# EAGLE design LifterV03 (EAGLE 9.6.2)

## Sheet 1 of 2: Analog Circuit
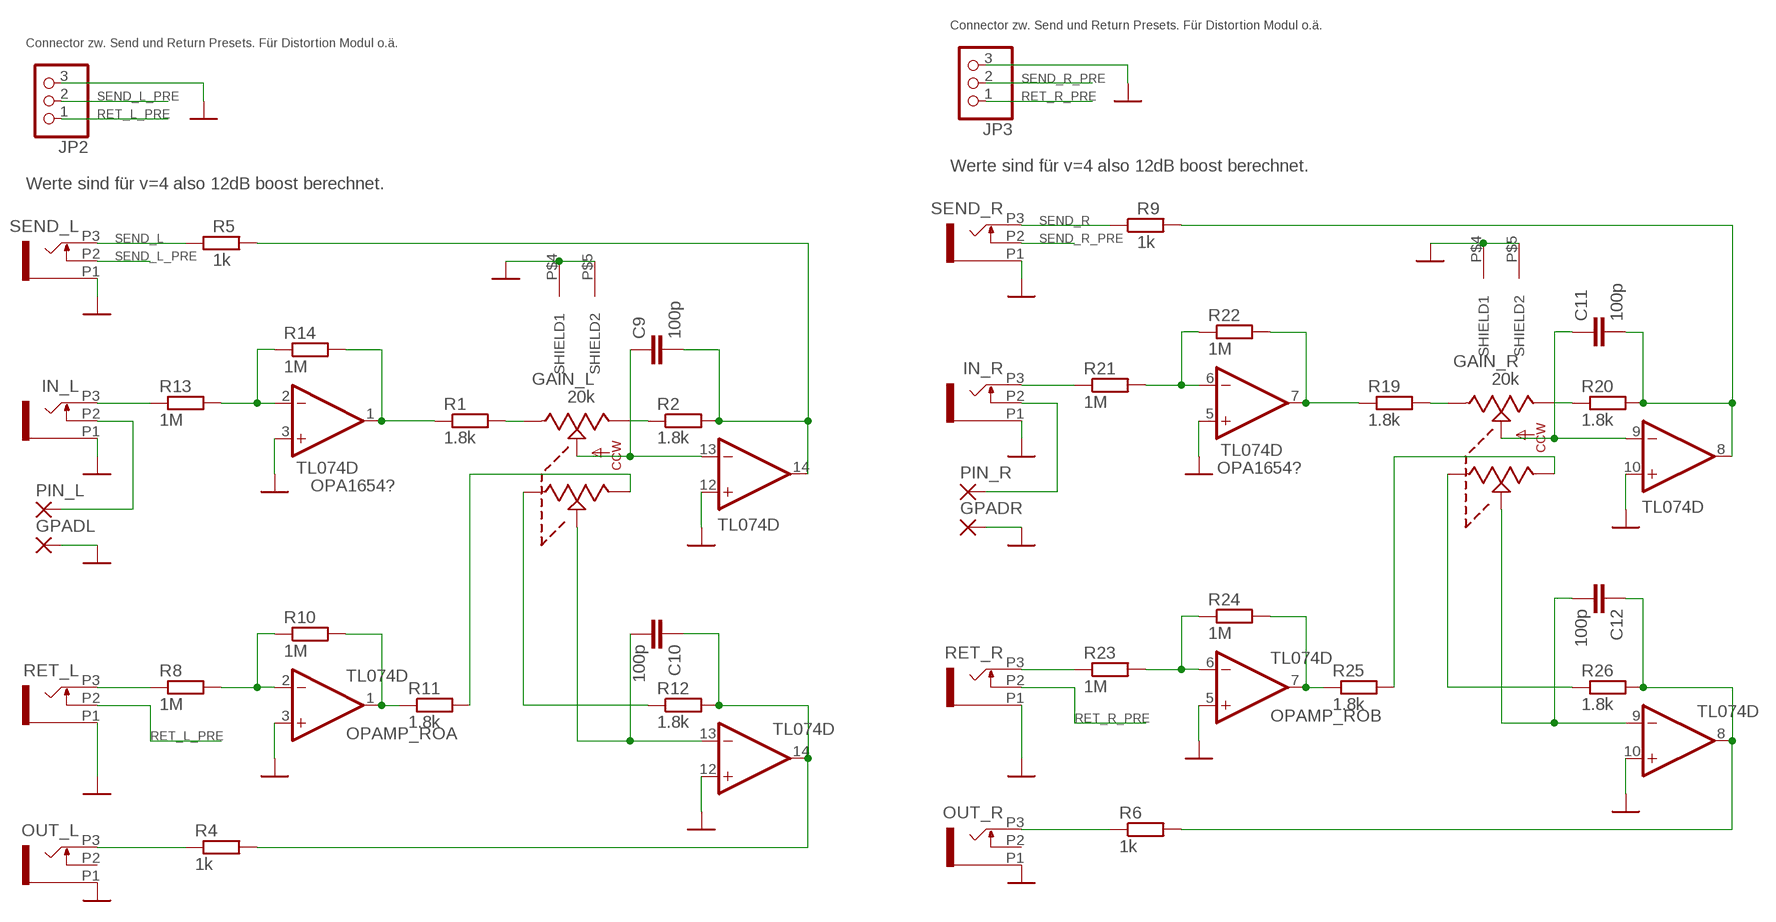
[diagram p0: schematic, sheet 1]

### Parts
C9  100p  C-EUC0603  [C0603]
C10  100p  C-EUC0603  [C0603]
C11  100p  C-EUC0603  [C0603]
C12  100p  C-EUC0603  [C0603]
GAIN_L  20k  POT_US_2X  [TT_2TAP_VERTICAL]
GAIN_R  20k  POT_US_2X  [TT_2TAP_VERTICAL]
GPADL  3,17/1,3  [3,17/1,3]
GPADR  3,17/1,3  [3,17/1,3]
IN_L  PJ301_THONKICONN6  [WQP_PJ_301M6]
IN_R  PJ301_THONKICONN6  [WQP_PJ_301M6]
JP2  PINHD-1X3  [1X03]
JP3  PINHD-1X3  [1X03]
OPAMP_IS  TL074D  [SO14]
OPAMP_RO  TL074D  [SO14]
OUT_L  PJ301_THONKICONN6  [WQP_PJ_301M6]
OUT_R  PJ301_THONKICONN6  [WQP_PJ_301M6]
PIN_L  3,17/1,3  [3,17/1,3]
PIN_R  3,17/1,3  [3,17/1,3]
R1  1.8k  R-EU_R0603  [R0603]
R2  1.8k  R-EU_R0603  [R0603]
R4  1k  R-EU_R0603  [R0603]
R5  1k  R-EU_R0603  [R0603]
R6  1k  R-EU_R0603  [R0603]
R8  1M  R-EU_R0603  [R0603]
R9  1k  R-EU_R0603  [R0603]
R10  1M  R-EU_R0603  [R0603]
R11  1.8k  R-EU_R0603  [R0603]
R12  1.8k  R-EU_R0603  [R0603]
R13  1M  R-EU_R0603  [R0603]
R14  1M  R-EU_R0603  [R0603]
R19  1.8k  R-EU_R0603  [R0603]
R20  1.8k  R-EU_R0603  [R0603]
R21  1M  R-EU_R0603  [R0603]
R22  1M  R-EU_R0603  [R0603]
R23  1M  R-EU_R0603  [R0603]
R24  1M  R-EU_R0603  [R0603]
R25  1.8k  R-EU_R0603  [R0603]
R26  1.8k  R-EU_R0603  [R0603]
RET_L  PJ301_THONKICONN6  [WQP_PJ_301M6]
RET_R  PJ301_THONKICONN6  [WQP_PJ_301M6]
SEND_L  PJ301_THONKICONN6  [WQP_PJ_301M6]
SEND_R  PJ301_THONKICONN6  [WQP_PJ_301M6]

### Nets
GND: GAIN_L.P$4(SHIELD1) GAIN_L.P$5(SHIELD2) GAIN_R.P$4(SHIELD1) GAIN_R.P$5(SHIELD2) GPADL.1(P) GPADR.1(P) IN_L.P1 IN_R.P1 JP2.3 JP3.3 OPAMP_IS.3(A:+IN) OPAMP_IS.5(B:+IN) OPAMP_IS.10(C:+IN) OPAMP_IS.12(D:+IN) OPAMP_RO.3(A:+IN) OPAMP_RO.5(B:+IN) OPAMP_RO.10(C:+IN) OPAMP_RO.12(D:+IN) OUT_L.P1 OUT_R.P1 RET_L.P1 RET_R.P1 SEND_L.P1 SEND_R.P1 ; also sheet 2
N$1: GAIN_L.CCW R2.1
N$2: GAIN_L.CW R1.2
N$3: C9.2 OPAMP_IS.14(D:OUT) R2.2 R5.2
N$4: C9.1 GAIN_L.CENTER OPAMP_IS.13(D:-IN)
N$5: IN_L.P3 R13.1
N$6: OPAMP_IS.2(A:-IN) R13.2 R14.1
N$8: OPAMP_IS.1(A:OUT) R1.1 R14.2
N$9: OUT_L.P3 R4.1
N$10: R8.1 RET_L.P3
N$11: IN_L.P2 PIN_L.1(P)
N$17: OPAMP_RO.2(A:-IN) R8.2 R10.1
N$18: GAIN_L.CW1 R12.1
N$21: OPAMP_RO.1(A:OUT) R10.2 R11.1
N$22: GAIN_L.CCW1 R11.2
N$23: C10.2 GAIN_L.CENTER1 OPAMP_RO.13(D:-IN)
N$24: C10.1 OPAMP_RO.14(D:OUT) R4.2 R12.2
N$26: IN_R.P2 PIN_R.1(P)
N$27: GAIN_R.CW R19.2
N$28: C11.1 GAIN_R.CENTER OPAMP_IS.9(C:-IN)
N$29: GAIN_R.CCW R20.1
N$30: IN_R.P3 R21.1
N$31: OPAMP_IS.6(B:-IN) R21.2 R22.1
N$32: OPAMP_IS.7(B:OUT) R19.1 R22.2
N$33: R23.1 RET_R.P3
N$34: OPAMP_RO.6(B:-IN) R23.2 R24.1
N$35: OPAMP_RO.7(B:OUT) R24.2 R25.1
N$36: GAIN_R.CCW1 R25.2
N$37: GAIN_R.CW1 R26.1
N$38: C12.2 GAIN_R.CENTER1 OPAMP_RO.9(C:-IN)
N$39: C11.2 OPAMP_IS.8(C:OUT) R9.2 R20.2
N$40: OUT_R.P3 R6.1
N$41: C12.1 OPAMP_RO.8(C:OUT) R6.2 R26.2
RET_L_PRE: JP2.1 RET_L.P2
RET_R_PRE: JP3.1 RET_R.P2
SEND_L: R5.1 SEND_L.P3 ; also sheet 2
SEND_L_PRE: JP2.2 SEND_L.P2
SEND_R: R9.1 SEND_R.P3 ; also sheet 2
SEND_R_PRE: JP3.2 SEND_R.P2
Unconnected: OUT_L.P2 OUT_R.P2

### Notes on the sheet
- Connector zw. Send und Return Presets. Für Distortion Modul o.ä.
- Connector zw. Send und Return Presets. Für Distortion Modul o.ä.
- Werte sind für v=4 also 12dB boost berechnet.
- Werte sind für v=4 also 12dB boost berechnet.
- OPA1654?
- OPA1654?

## Sheet 2 of 2: Power Supply
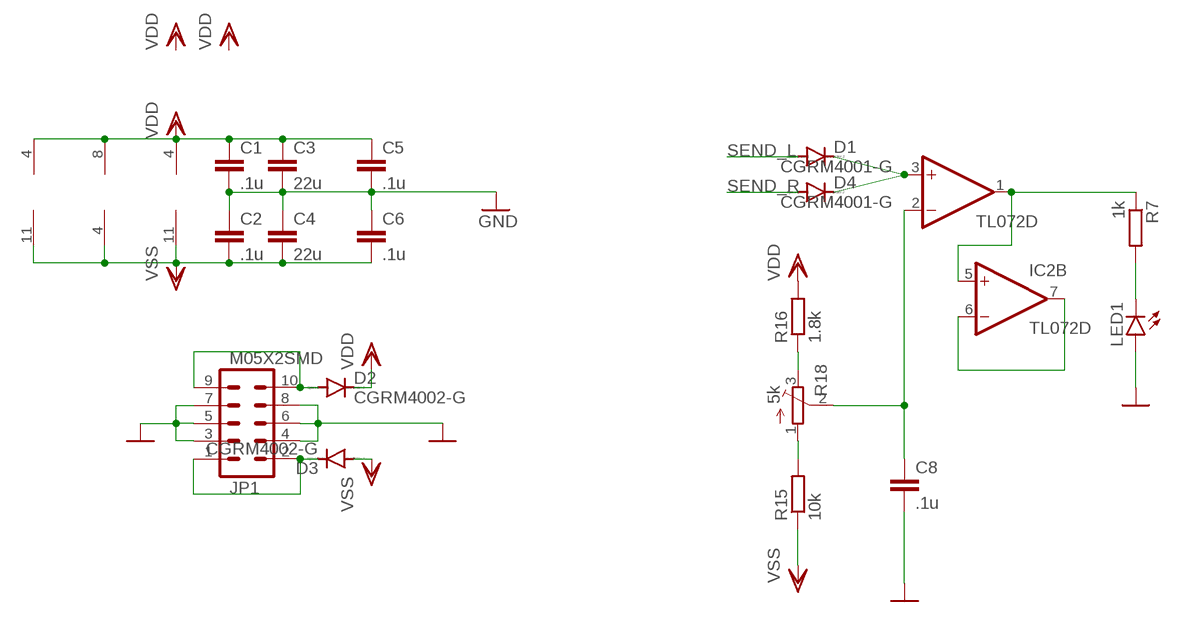
[diagram p1: schematic, sheet 2]

### Parts
C1  .1u  C-EUC0603  [C0603]
C2  .1u  C-EUC0603  [C0603]
C3  22u  C-EUC1210  [C1210]
C4  22u  C-EUC1210  [C1210]
C5  .1u  C-EUC0603  [C0603]
C6  .1u  C-EUC0603  [C0603]
C8  .1u  C-EUC0603  [C0603]
D1  CGRM4001-G  [SOD-123_MINI-SMA]
D2  CGRM4002-G  [SOD-123_MINI-SMA]
D3  CGRM4002-G  [SOD-123_MINI-SMA]
D4  CGRM4001-G  [SOD-123_MINI-SMA]
IC2  TL072D  [SO08]
JP1  M05X2SMD  [2X5-SMD]
LED1  LED3MM  [LED3MM]
R7  1k  R-EU_R0603  [R0603]
R15  10k  R-EU_R0603  [R0603]
R16  1.8k  R-EU_R0603  [R0603]
R18  5k  TRIM_EU-3223G  [3223G]

### Nets
GND: C1.2 C2.1 C3.2 C4.1 C5.2 C6.1 C8.2 JP1.3 JP1.4 JP1.5 JP1.6 JP1.7 JP1.8 LED1.A ; also sheet 1
N$7: IC2.6(B:-IN) IC2.7(B:OUT)
N$12: D2.A JP1.9 JP1.10
N$13: D1.C D4.C IC2.3(A:+IN)
N$14: D3.C JP1.1 JP1.2
N$15: LED1.K(C) R7.2
N$16: IC2.1(A:OUT) IC2.5(B:+IN) R7.1
N$19: C8.1 IC2.2(A:-IN) R18.2(S)
N$25: R16.1 R18.3(E)
N$44: R15.2 R18.1(A)
SEND_L: D1.A ; also sheet 1
SEND_R: D4.A ; also sheet 1
VDD [power]: C1.1 C3.1 C5.1 D2.C IC2.8(P:V+) OPAMP_IS.4(P:V+) OPAMP_RO.4(P:V+) R16.2
VSS [power]: C2.2 C4.2 C6.2 D3.A IC2.4(P:V-) OPAMP_IS.11(P:V-) OPAMP_RO.11(P:V-) R15.1

## Library data of the parts
C1-C6 C8-C12 = rcl:C-EU: CAPACITOR, European symbol; SPICEPREFIX: C
D1-D4 = diode:CGRM400*-G: Molded plasitc,JEDEC SOD-123/Mini SMA Source: Comchip CGRM4001-G.pdf
GAIN_L GAIN_R = og-pots:POT_US_2X
GPADL GPADR PIN_L PIN_R = wirepad:3,17/1,3: THROUGH-HOLE PAD
IC2 = linear:TL072: OP AMP
IN_L IN_R OUT_L OUT_R RET_L RET_R SEND_L SEND_R = og-pj301:PJ301_THONKICONN
JP1 = og-header:M05X2: Header 5x2 Standard 10-pin dual row 0.1" header. Commonly used with AVR-ISP. Use with Spark Fun Electronics SKU: PRT-00778
JP2 JP3 = pinhead:PINHD-1X3: PIN HEADER
LED1 = led:LED: LED OSRAM: - CHIPLED LG R971, LG N971, LY N971, LG Q971, LY Q971, LO R971, LY R971 LH N974, LH R974 LS Q976, LO Q976, LY Q976 LO Q996 - Hyper CHIPLED LW Q18S LB Q993, LB Q99A, LB R99A - SideLED LS A670, LO A670, LY A670, LG A670, LP A670 LB A673, LV A673, LT A673, LW A673 LH A674 LY A675 LS A676, LA A676, LO A676, LY A676, LW A676 LS A679, LY A679, LG A679 - Hyper Micro SIDELED® LS Y876, LA Y876, LO Y876, LY Y876 LT Y87S - SmartLED LW L88C, LW L88S LB L89C, LB L89S, LG L890 LS L89K, LO L89K, LY L89K LS L896, LA L896, LO L896, LY L896 - TOPLED LS T670, LO T670, LY T670, LG T670, LP T670 LSG T670, LSP T670, LSY T670, LOP T670, LYG T670 LG T671, LOG T671, LSG T671 LB T673, LV T673, LT T673, LW T673 LH T674 LS T676, LA T676, LO T676, LY T676, LB T676, LH T676, LSB T676, LW T676 LB T67C, LV T67C, LT T67C, LS T67K, LO T67K, LY T67K, LW E67C LS E67B, LA E67B, LO E67B, LY E67B, LB E67C, LV E67C, LT E67C LW T67C LS T679, LY T679, LG T679 LS T770, LO T770, LY T770, LG T770, LP T770 LB T773, LV T773, LT T773, LW T773 LH T774 LS E675, LA E675, LY E675, LS T675 LS T776, LA T776, LO T776, LY T776, LB T776 LHGB T686 LT T68C, LB T68C - Hyper Mini TOPLED® LB M676 - Mini TOPLED Santana® LG M470 LS M47K, LO M47K, LY M47K Source: http://www.osram.convergy.de LUXEON: - LUMILED® LXK2-PW12-R00, LXK2-PW12-S00, LXK2-PW14-U00, LXK2-PW14-V00 LXK2-PM12-R00, LXK2-PM12-S00, LXK2-PM14-U00 LXK2-PE12-Q00, LXK2-PE12-R00, LXK2-PE12-S00, LXK2-PE14-T00, LXK2-PE14-U00 LXK2-PB12-K00, LXK2-PB12-L00, LXK2-PB12-M00, LXK2-PB14-N00, LXK2-PB14-P00, LXK2-PB14-Q00 LXK2-PR12-L00, LXK2-PR12-M00, LXK2-PR14-Q00, LXK2-PR14-R00 LXK2-PD12-Q00, LXK2-PD12-R00, LXK2-PD12-S00 LXK2-PH12-R00, LXK2-PH12-S00 LXK2-PL12-P00, LXK2-PL12-Q00, LXK2-PL12-R00 Source: www.luxeon.com KINGBRIGHT: KA-3528ASYC Source: www.kingbright.com
OPAMP_IS OPAMP_RO = linear:TL074: OP AMP; SPICEPREFIX: J
R1 R2 R4-R16 R19-R26 = rcl:R-EU_: RESISTOR, European symbol; SPICEPREFIX: R
R18 = pot:TRIM_EU-: POTENTIOMETER; MOUSER: 652-TC33X-2-502G

## Net classes
1 power: width 0.406 mm

## Board
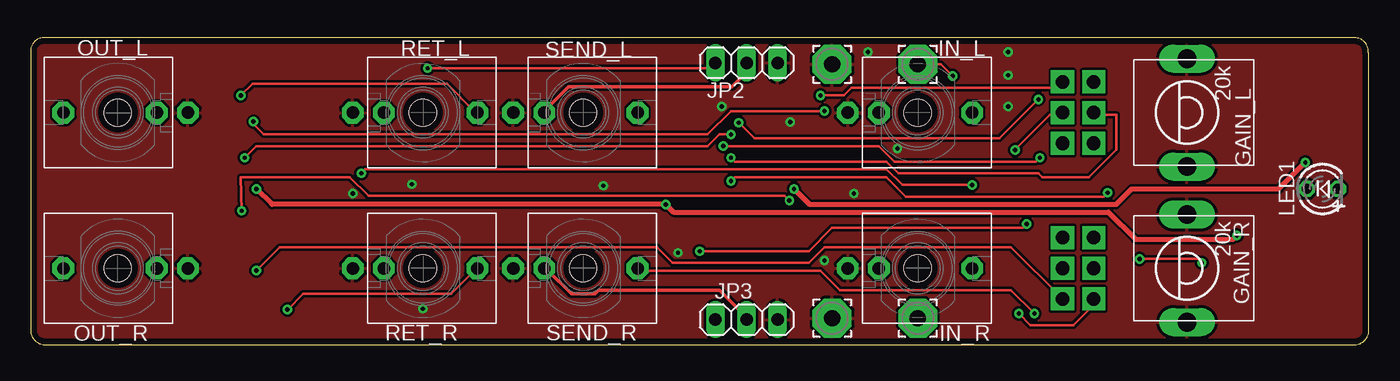
[diagram p2: board, top side]
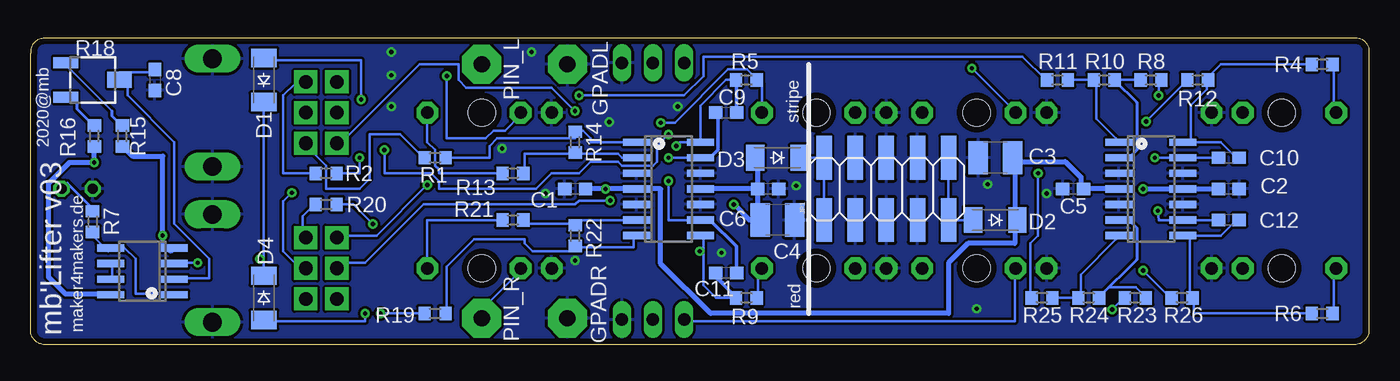
[diagram p3: board, bottom side, seen from below]

Size 109.21 x 25.03 mm. Coordinates in mm from the lower left corner, seen from the top.
Outline: 0,1.27 arc100 1.27,0 107.95,0 arc100 109.2,1.25 109.2,23.68 arc10 109.17,23.8 arc100 107.95,25.02 1.15,25.02 arc100 0,23.88 0,1.27
Copper layers (1*16): Top 0.035mm / dielectric 1.5mm / Bottom 0.035mm
Design rules "default *": minimum track width 8mil, minimum drill 0.35mm, track to track 8mil, track to pad 8mil, pad to pad 8mil, via to via 8mil, smd to smd 8mil, copper to edge 20mil, drill to drill 8mil, minimum pad ring 10mil, minimum via ring 8mil, stop-mask expansion 4mil, vias tented up to drill 0mil, thermal gap 10mil

### Footprints (pad centres in the part's own frame; a part is rotated, then mirrored left to right if it is on the bottom)
C0603 = smd 1.1 x 1: 1 -0.85,0; 2 0.85,0
C1210 = smd 1.6 x 2.7: 1 -1.4,0; 2 1.4,0
SOD-123_MINI-SMA = smd 1.5 x 2.1: A 1.8,0; C -1.8,0
TT_2TAP_VERTICAL = drill 1.118 pad 1.88 square: CCW 2.5,7.608; CCW1 2.5,10.148; CENTER 0,7.608; CENTER1 0,10.148; CW -2.5,7.608; CW1 -2.5,10.148 | drill 1.524 pad 2.184 long: P$4 -4.4,0; P$5 4.4,0
3,17/1,3 = drill 1.321 pad 3.175 octagon: 1 0,0
SO08 = smd 0.6 x 2.2: 1 -1.905,-2.6; 2 -0.635,-2.6; 3 0.635,-2.6; 4 1.905,-2.6; 5 1.905,2.6; 6 0.635,2.6; 7 -0.635,2.6; 8 -1.905,2.6
WQP_PJ_301M6 = drill 1.016 pad 1.778 octagon: P1 0,-5.715; P2 0,-3.175; P3 0,4.445 | hole 2.2: 0,0
2X5-SMD = smd 3.556 x 1.27: 1 -2.54,5.08; 2 2.54,5.08; 3 -2.54,2.54; 4 2.54,2.54; 5 -2.54,0; 6 2.54,0; 7 -2.54,-2.54; 8 2.54,-2.54; 9 -2.54,-5.08; 10 2.54,-5.08
1X03 = drill 1.016 long: 1 -2.54,0; 2 0,0; 3 2.54,0
LED3MM = drill 0.813 octagon: A -1.27,0; K 1.27,0
SO14 = smd 0.6 x 2.2: 1 -3.81,-2.6; 2 -2.54,-2.6; 3 -1.27,-2.6; 4 0,-2.6; 5 1.27,-2.6; 6 2.54,-2.6; 7 3.81,-2.6; 8 3.81,2.6; 9 2.54,2.6; 10 1.27,2.6; 11 0,2.6; 12 -1.27,2.6; 13 -2.54,2.6; 14 -3.81,2.6
R0603 = smd 1 x 1.1: 1 -0.85,0; 2 0.85,0
3223G = smd 2 x 0.9: 1 -2.2,1.4; 3 -2.2,-1.4 | smd 2 x 1.3: 2 2.2,0

### Placement (x,y rotation side)
C1  64.77,12.7 180 bottom
C2  11.43,12.7 180 bottom
C3  30.48,15.24 180 bottom
C4  48.26,10.16 180 bottom
C5  24.13,12.7 180 bottom
C6  49.03,12.7 180 bottom
C8  99.06,21.59 270 bottom
C9  52.46,18.93 0 bottom
C10  11.43,15.24 180 bottom
C11  52.46,5.85 180 bottom
C12  11.43,10.16 180 bottom
D1  90.17,21.59 90 bottom
D2  30.48,10.16 180 bottom
D3  48.26,15.24 180 bottom
D4  90.17,3.81 270 bottom
GAIN_L  94.37,18.93 90 top
GAIN_R  94.37,6.23 90 top
GPADL  65.41,22.86 0 top
GPADR  65.41,2.16 0 top
IC2  100.08,5.97 90 bottom
IN_L  72.39,18.93 270 top
IN_R  72.39,6.23 270 top
JP1  39.37,12.7 90 bottom
JP2  58.42,22.99 0 top
JP3  58.42,2.04 0 top
LED1  105.41,12.7 0 top
OPAMP_IS  57.15,12.7 270 bottom
OPAMP_RO  17.78,12.7 270 bottom
OUT_L  7.12,18.93 90 top
OUT_R  7.12,6.23 90 top
PIN_L  72.39,22.86 180 top
PIN_R  72.39,2.16 0 top
R1  76.2,15.24 180 bottom
R2  85.09,13.97 0 bottom
R4  3.81,22.86 180 bottom
R5  50.8,21.59 180 bottom
R6  3.81,2.54 180 bottom
R7  104.14,10.04 90 bottom
R8  17.78,21.59 180 bottom
R9  50.8,3.81 180 bottom
R10  21.59,21.59 180 bottom
R11  25.4,21.59 180 bottom
R12  13.97,21.59 0 bottom
R13  69.85,13.97 0 bottom
R14  64.77,16.51 90 bottom
R15  101.73,17.02 90 bottom
R16  104.02,17.02 270 bottom
R18  104.14,21.59 0 bottom
R19  76.2,2.54 180 bottom
R20  85.09,11.43 0 bottom
R21  69.85,10.16 0 bottom
R22  64.77,8.89 270 bottom
R23  19.05,3.81 0 bottom
R24  22.86,3.81 180 bottom
R25  26.67,3.81 180 bottom
R26  15.24,3.81 0 bottom
RET_L  32.01,18.93 270 top
RET_R  32.01,6.23 270 top
SEND_L  45.09,18.93 270 top
SEND_R  45.09,6.23 270 top

### Tracks (layer width: path | path; a pad name or v marks a point on that pad's centre or on a via)
GND  (via drill 0.35)
  other vias: 61.98,18.17 79.76,19.44 79.76,21.98 79.76,23.88 68.33,23.88 56.39,19.44 32.01,2.93 70.74,16.01 67.19,12.32 64.77,6.86 52.84,7.5 46.74,12.96 31.12,13.09 26.29,12.32
  pour Bottom: 110.49,26.67 110.49,-1.27 -1.27,-1.27 -1.27,26.67
  pour Top: 111.76,27.94 111.76,-1.27 -1.27,-1.27 -1.27,26.67 110.49,26.67
N$1
  Bottom 0.203: R2.1 88.59,13.97 88.59,20.32 87.63,21.28 87,21.28 GAIN_L.CCW
N$2
  Bottom 0.203: R1.2 77.16,15.24 79.06,17.15 81.54,17.15 81.54,13.53 82.36,12.7 85.09,12.7 85.09,14.61 86.68,16.2 GAIN_L.CW
N$3  (via drill 0.35)
  Top 0.203: v82.36,15.24 82.05,14.93 70.49,14.93 69.22,16.2 v56.52,16.2
  Bottom 0.203: R2.2 82.36,13.97 v82.36,15.24 | v56.52,16.2 56.2,16.51 OPAMP_IS.14 54.55,19.49 52.45,21.59 R5.2
  Bottom 0.305: C9.2 51.61,21.55 R5.2
N$4  (via drill 0.35)
  Top 0.203: v57.15,15.24 57.47,14.93 69.85,14.93 70.81,13.97 82.24,13.97 82.55,13.66 86.36,13.66 88.59,15.88 88.59,18.74 87,18.74 GAIN_L.CENTER
  Bottom 0.203: v57.15,15.24 OPAMP_IS.13
  Bottom 0.305: C9.1 53.1,18.72 53.1,15.9 53.75,15.24 OPAMP_IS.13
N$5
  Bottom 0.203: R13.1 75.89,13.97 75.89,14.29 76.2,14.61 76.2,15.88 76.84,16.51 IN_L.P3
N$6
  Bottom 0.203: 64.77,15.56 68.9,15.56 68.9,13.97 R13.2 | OPAMP_IS.2 60.96,15.24 61.28,15.56 64.77,15.56 | 64.77,15.56 R14.1
N$7
  Bottom 0.203: IC2.7 102.56,5.4 102.56,6.35 IC2.6
N$8
  Bottom 0.203: R1.1 71.76,15.24 71.76,16.2 71.12,16.83 64.77,16.83 R14.2 64.77,17.47 64.14,17.47 63.5,16.83 63.5,16.51 OPAMP_IS.1
N$9
  Bottom 0.203: R4.1 2.86,22.86 2.86,19.05 OUT_L.P3
N$10  (via drill 0.35)
  Top 0.203: v17.15,20.32 18.1,21.28 33.98,21.28 36.2,19.05 RET_L.P3
  Bottom 0.203: v17.15,20.32 17.15,21.59 R8.1
N$11  (via drill 0.35)
  Top 0.203: v75.25,21.91 74.3,22.86 PIN_L.1
  Bottom 0.203: v75.25,21.91 75.25,16.83 72.08,16.83 71.44,17.47 70.49,17.47 69.22,18.74 IN_L.P2
N$12
  Bottom 0.203: D2.A JP1.9 JP1.10
N$13  (via drill 0.35)
  Top 0.203: v95.57,6.67 95.25,6.99 v90.49,6.99
  Bottom 0.203: D1.C 90.17,6.99 | 90.17,6.99 D4.C | v95.57,6.67 97.48,6.67 IC2.3 | 90.17,6.99 v90.49,6.99
N$14
  Bottom 0.203: D3.C JP1.2 JP1.1
N$15
  Bottom 0.254: LED1.K 106.22,13.17 104.14,11.1 R7.2
N$16
  Bottom 0.203: R7.1 104.14,8.89 102.87,7.62 IC2.5 102.56,7.94 101.6,7.94 100.65,6.99 100.65,4.13 97.79,4.13 IC2.1
N$17
  Bottom 0.203: R10.1 R8.2
  Bottom 0.254: R10.1 20.74,21.54 18.95,19.75 18.95,15.87 19.58,15.24 OPAMP_RO.2
N$18  (via drill 0.35)
  Top 0.203: v64.77,19.05 57.15,19.05 55.25,17.15 19.05,17.15 19,17.17 18.19,17.99 v18.19,18.19
  Bottom 0.203: v64.77,19.05 66.68,20.96 73.66,20.96 74.3,21.59 74.3,22.86 77.47,22.86 83.82,16.51 GAIN_L.CW1 | v18.19,18.19 14.84,21.54 R12.1
N$19
  Bottom 0.203: 101.29,22.23 101.92,22.23 101.92,21.59 R18.2 101.29,22.23 | 101.29,22.23 99.06,22.23 C8.1 | 101.29,22.23 101.29,20.32 97.48,16.51 97.48,9.85 94.62,6.99 94.62,5.4 97.48,5.4 IC2.2
N$21
  Bottom 0.203: R11.1 R10.2 22.23,21.59 22.23,18.42 20.64,16.83 20.64,16.51 OPAMP_RO.1
N$22  (via drill 0.35)
  Top 0.203: v64.46,20.32 66.36,20.32 67,20.96 83.82,20.96 84.14,21.28 GAIN_L.CCW1
  Bottom 0.203: v64.46,20.32 55.88,20.32 54.3,21.91 54.3,23.5 28.26,23.5 26.36,21.59 R11.2
N$23  (via drill 0.35)
  Top 0.203: v17.47,15.24 18.42,16.2 55.25,16.2 56.2,17.15 v57.15,17.15 | v80.33,15.88 83.19,18.74 84.14,18.74 GAIN_L.CENTER1
  Bottom 0.203: v17.47,15.24 OPAMP_RO.13 C10.2 | v57.15,17.15 58.11,16.2 58.11,14.93 58.42,14.61 60.96,14.61 61.28,14.93 63.5,14.93 64.46,13.97 66.68,13.97 67.95,12.7 75.89,12.7 75.89,13.34 76.52,13.97 80.33,13.97 v80.33,15.88
N$24
  Bottom 0.203: R4.2 12.09,22.86 13.11,21.85 13.11,21.65 R12.2 13.21,21.54 13.21,20.83 14.53,19.51 14.53,16.51 | 14.93,16.51 OPAMP_RO.14 14.53,16.51 | 14.53,16.51 12.07,16.51 10.8,15.24 C10.1
N$25
  Bottom 0.203: 105.41,19.69 106.05,20.32 R18.3
  Bottom 0.254: R16.1 104.07,17.87 105.41,19.22 105.41,19.69
N$26
  Bottom 0.203: PIN_R.1 72.39,2.86 69.22,6.04 IN_R.P2
N$27  (via drill 0.35)
  Top 0.203: v80.65,2.54 81.6,1.59 85.09,1.59 87,3.5 GAIN_R.CW
  Bottom 0.203: v80.65,2.54 R19.2
N$28  (via drill 0.35)
  Top 0.203: v57.15,13.34 57.47,13.66 69.85,13.66 71.44,12.07 87.57,12.07 v87.89,12.39
  Bottom 0.203: OPAMP_IS.9 57.15,10.16 v57.15,13.34 | v87.89,12.39 88.59,11.69 88.59,7.62 87,6.04 GAIN_R.CENTER
  Bottom 0.305: OPAMP_IS.9 53.75,10.16 51.61,8.02 C11.1
N$29
  Bottom 0.203: R20.1 86.05,11.43 87,10.48 87,8.89 GAIN_R.CCW
N$30
  Bottom 0.203: R21.1 76.84,10.16 IN_R.P3
N$31
  Bottom 0.203: 64.77,9.85 68.9,9.85 68.9,10.16 R21.2 | OPAMP_IS.6 64.77,10.16 64.77,9.85 | 64.77,9.85 R22.1
N$32
  Bottom 0.203: 64.77,7.94 60.01,7.94 60.01,8.89 OPAMP_IS.7 | 64.77,7.94 64.77,7.62 68.27,7.62 68.9,8.26 68.9,8.58 73.03,8.58 75.25,6.35 75.25,2.54 R19.1 | 64.77,7.94 R22.2
N$33  (via drill 0.35)
  Top 0.203: v20.96,2.86 22.23,4.13 34.29,4.13 36.2,6.04 RET_R.P3
  Bottom 0.203: v20.96,2.86 20.01,3.81 R23.1
N$34
  Bottom 0.203: R23.2 18.2,3.86 19.01,4.67 21.21,4.67 22.01,3.86
  Bottom 0.254: OPAMP_RO.6 19.58,10.16 18.95,9.53 18.95,6.92 22.01,3.86 R24.1
N$35
  Bottom 0.203: R25.1 R24.2 23.5,3.81 23.5,5.72 20.64,8.58 20.64,8.89 OPAMP_RO.7
N$36  (via drill 0.35)
  Top 0.203: v26.99,13.97 27.31,14.29 69.85,14.29 71.12,13.02 v76.84,13.02
  Bottom 0.203: v26.99,13.97 26.99,8.89 27.63,8.26 27.63,3.81 R25.2 | v76.84,13.02 80.97,8.89 84.14,8.89 GAIN_R.CCW1
N$37  (via drill 0.35)
  Top 0.203: v18.42,6.04 20.32,7.94 51.12,7.94 52.39,6.67 63.5,6.67 64.77,7.94 80.01,7.94 84.14,3.81 GAIN_R.CW1
  Bottom 0.203: v18.42,6.04 16.2,3.81 R26.1
N$38  (via drill 0.35)
  Top 0.203: v17.21,10.93 17.15,13.66 26.04,13.66 27.56,12.13 61.54,12.13 v61.92,11.75
  Bottom 0.203: v17.21,10.93 17.15,10.16 OPAMP_RO.9 C12.2 | v61.92,11.75 64.46,11.75 64.77,11.43 77.16,11.43 81.92,6.67 84.14,6.67 84.14,6.35 GAIN_R.CENTER1
  Bottom 0.305: OPAMP_RO.9 15.98,10.16
N$39  (via drill 0.35)
  Top 0.203: v81.28,9.85 80.97,9.53 65.41,9.53 63.5,7.62 v54.61,7.62
  Bottom 0.203: 54.3,7.62 54.3,8.89 OPAMP_IS.8 | 54.3,7.62 54.3,4.83 53.28,3.81 R9.2 | v81.28,9.85 82.87,11.43 R20.2 | 54.3,7.62 v54.61,7.62 | C11.2 53.34,5.72 52.71,5.08 52.79,5
  Bottom 0.305: R9.2 51.65,3.86 52.79,5 53.31,5.52
N$40
  Bottom 0.203: R6.1 2.86,2.54 2.86,6.04 OUT_R.P3
N$41
  Bottom 0.203: R6.2 14.29,2.54 14.29,3.81 R26.2 14.61,3.81 14.61,8.58 14.93,8.89 OPAMP_RO.8 12.07,8.89 10.8,10.16 C12.1
N$44
  Bottom 0.203: 102.56,19.05 106.05,22.55 106.05,22.86 R18.1
  Bottom 0.254: R15.2 101.78,17.87 102.56,18.65 102.56,19.05
RET_L_PRE  (via drill 0.35)
  Top 0.203: v32.39,22.55 55.57,22.55 55.88,22.86 JP2.1
  Bottom 0.203: v32.39,22.55 28.9,19.05 RET_L.P2
RET_R_PRE
  Bottom 0.203: JP3.1 55.88,1.91 28.9,1.91 28.9,6.04 RET_R.P2
SEND_L  (via drill 0.35)
  Top 0.203: v82.24,20.01 79.06,16.83 59.06,16.83 v57.79,18.1
  Bottom 0.203: SEND_L.P3 49.53,21.28 49.85,21.59 R5.1 49.95,21.64 50.76,22.45 52.28,22.45 56.63,18.1 v57.79,18.1 | v82.24,20.01 82.24,23.18 90.17,23.18 D1.A
SEND_L_PRE
  Top 0.305: SEND_L.P2 41.91,19.05 43.88,21.02 57.22,21.02 58.42,22.23 JP2.2
SEND_R  (via drill 0.35)
  Top 0.203: v81.92,2.54 80.01,4.45 66.04,4.45 64.46,6.04 49.53,6.04 SEND_R.P3
  Bottom 0.203: R9.1 49.85,3.81 49.85,5.72 49.53,6.04 SEND_R.P3 | v81.92,2.54 81.92,1.91 90.17,1.91 D4.A
SEND_R_PRE
  Top 0.305: SEND_R.P2 41.91,6.04 42.23,6.04 44.14,4.13 46.04,4.13 46.36,4.45 56.2,4.45 58.42,2.23 JP3.2
VDD  (via drill 0.35)
  Top 0.406: v62.3,12.7 63.57,11.43 88.59,11.43 89.86,12.7 101.86,12.7 v104.02,14.86
  Bottom 0.406: IC2.8 102.87,4.13 106.37,4.13 107.75,5.52 107.75,13.15 106.03,14.86 v104.02,14.86 R16.2 | C1.1 v62.3,12.7 OPAMP_IS.4 57.79,12.7 57.79,6.61 53.73,2.54 34.29,2.54 34.29,6.67 32.71,8.26 28.9,8.26 28.9,10.16 | OPAMP_RO.4 C5.1 23.5,12.7 23.5,13.66 24.77,14.93 28.9,14.93 | 28.9,14.93 28.9,15.24 C3.1 28.9,14.93 | 28.9,14.93 28.9,10.16 | 28.9,10.16 D2.C
VSS  (via drill 0.35)
  Top 0.406: v18.42,12.7 19.69,11.43 v51.82,11.43 52.46,10.8 87.95,10.8 90.17,8.58 98.11,8.58 v98.43,8.89
  Bottom 0.406: IC2.4 97.79,7.62 98.43,8.26 v98.43,8.89 98.43,15.37 100.88,15.37 101.68,16.17 R15.1 | C2.2 OPAMP_RO.11 v18.42,12.7 | 49.85,12.7 49.85,10.16 C4.2 50.55,10.16 v51.82,11.43 | 49.85,12.7 49.85,15.24 D3.A | 49.85,12.7 C6.2 OPAMP_IS.11

### Text on the board
bNames: 2020@mb | stripe | maker4makers.de | red | mb'Lifter v03